# EAGLE design pc-bus (EAGLE 9.6.2)
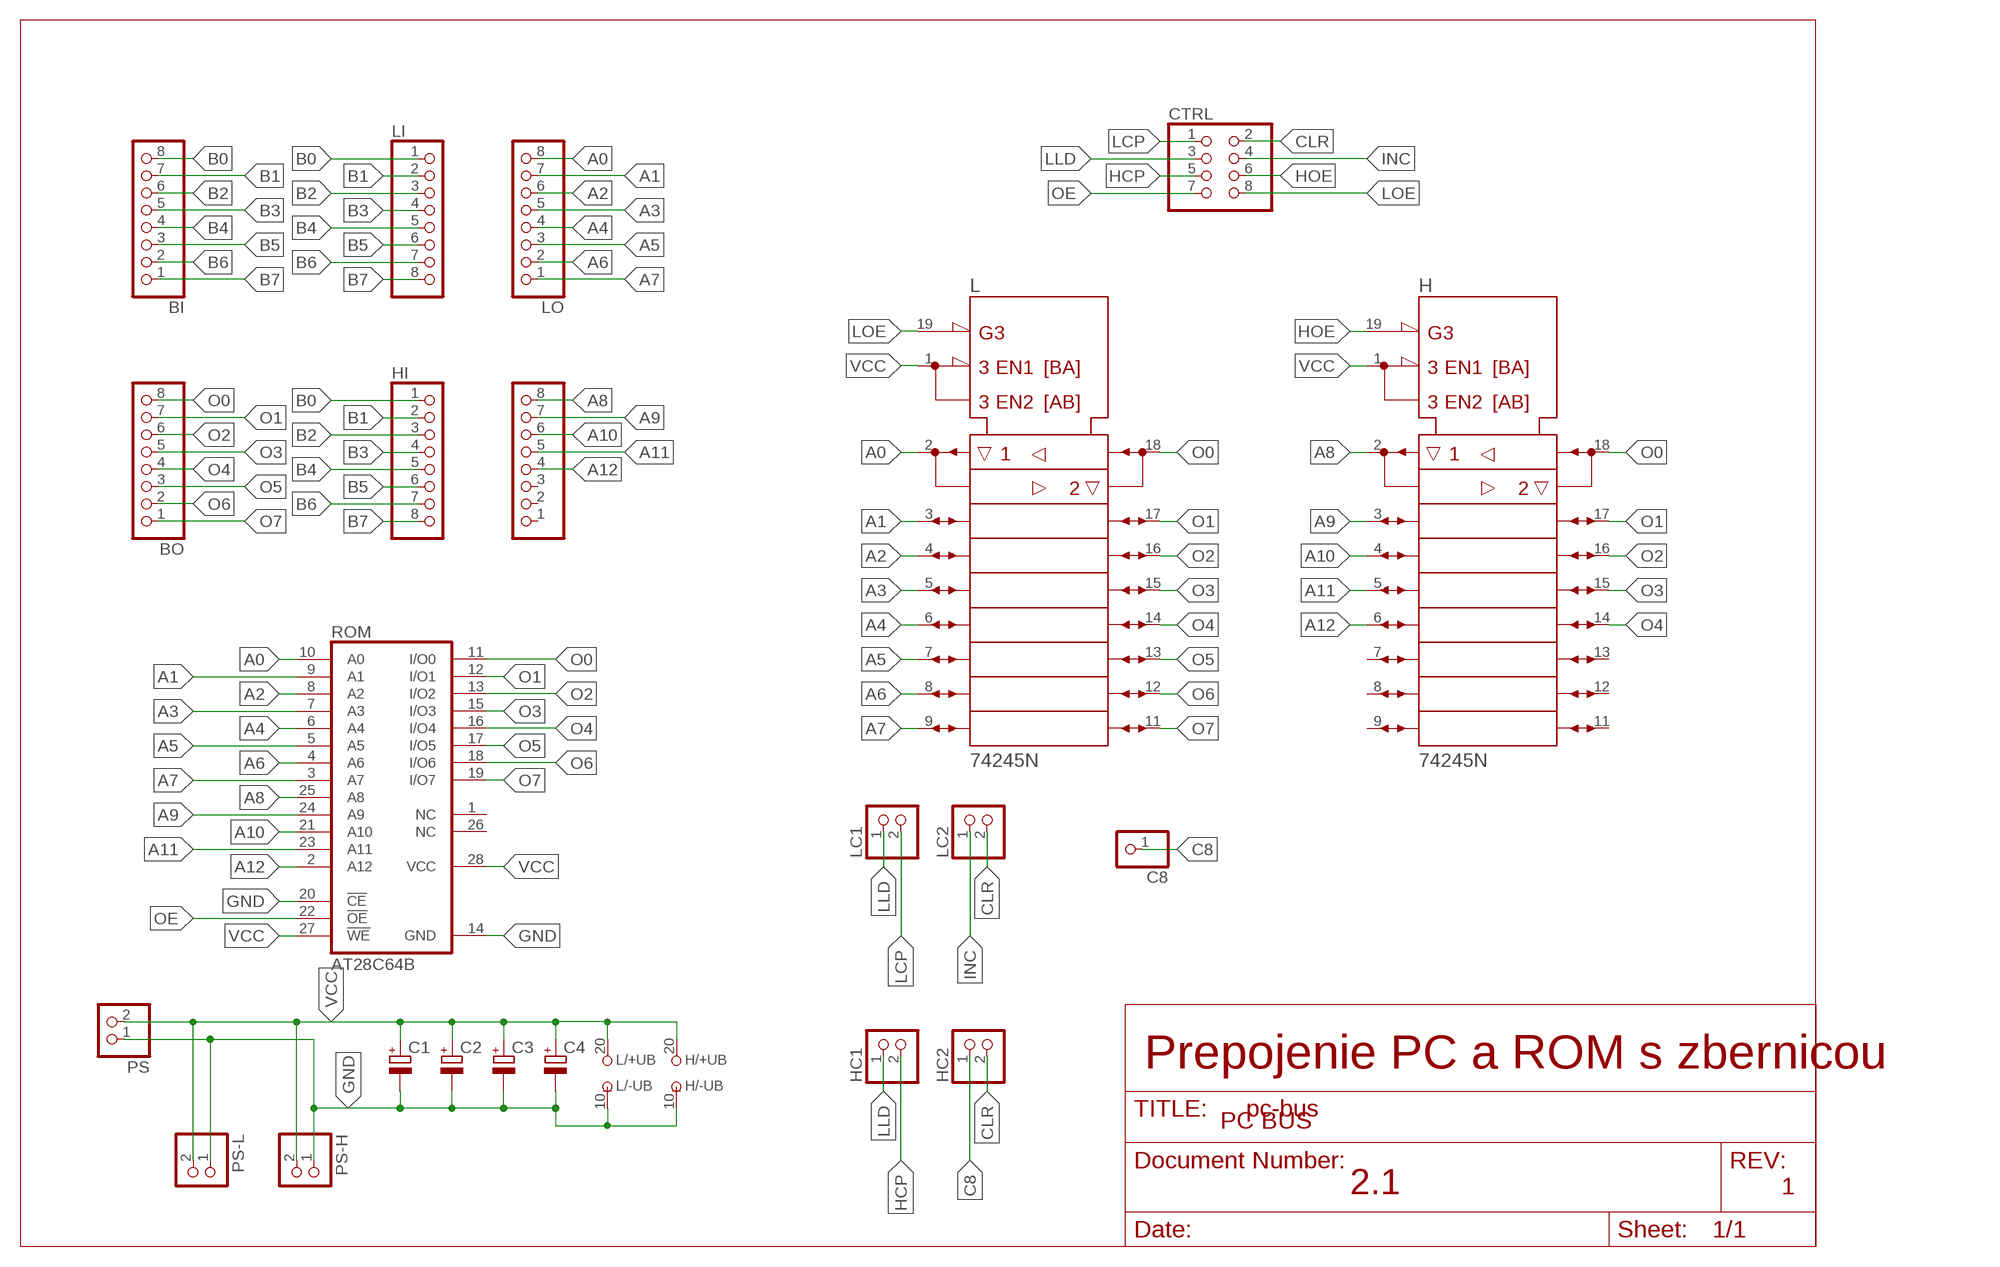
[diagram p0: schematic, sheet 1]

## Parts
BI  PINHD-1X8  [1X08]
BO  PINHD-1X8  [1X08]
C1  CPOL-EUE2.5-6  [E2,5-6]
C2  CPOL-EUE2.5-6  [E2,5-6]
C3  CPOL-EUE2.5-6  [E2,5-6]
C4  CPOL-EUE2.5-6  [E2,5-6]
C8  PINHD-1X1  [1X01]
CTRL  PINHD-2X4  [2X04]
H  74245N  [DIL20]
HC1  PINHD-1X2  [1X02]
HC2  PINHD-1X2  [1X02]
HI  PINHD-1X8  [1X08]
HO  PINHD-1X8  [1X08]
L  74245N  [DIL20]
LC1  PINHD-1X2  [1X02]
LC2  PINHD-1X2  [1X02]
LI  PINHD-1X8  [1X08]
LO  PINHD-1X8  [1X08]
PS  PINHD-1X2  [1X02]
PS-H  PINHD-1X2  [1X02]
PS-L  PINHD-1X2  [1X02]
ROM  AT28C64B  28C64C  [DIL28-6]

## Nets
A0: L.2(A1) LO.8 ROM.10(A0)
A1: L.3(A2) LO.7 ROM.9(A1)
A2: L.4(A3) LO.6 ROM.8(A2)
A3: L.5(A4) LO.5 ROM.7(A3)
A4: L.6(A5) LO.4 ROM.6(A4)
A5: L.7(A6) LO.3 ROM.5(A5)
A6: L.8(A7) LO.2 ROM.4(A6)
A7: L.9(A8) LO.1 ROM.3(A7)
A8: H.2(A1) HO.8 ROM.25(A8)
A9: H.3(A2) HO.7 ROM.24(A9)
A10: H.4(A3) HO.6 ROM.21(A10)
A11: H.5(A4) HO.5 ROM.23(A11)
A12: H.6(A5) HO.4 ROM.2(A12)
B0: BI.8 HI.1 LI.1
B1: BI.7 HI.2 LI.2
B2: BI.6 HI.3 LI.3
B3: BI.5 HI.4 LI.4
B4: BI.4 HI.5 LI.5
B5: BI.3 HI.6 LI.6
B6: BI.2 HI.7 LI.7
B7: BI.1 HI.8 LI.8
C8: C8.1 HC2.1
CLR: CTRL.2 HC2.2 LC2.2
GND: C1.- C2.- C3.- C4.- H.10(-UB) L.10(-UB) PS-H.1 PS-L.1 PS.1 ROM.14(GND) ROM.20(!CE)
HCP: CTRL.5 HC1.2
HOE: CTRL.6 H.19(!G)
INC: CTRL.4 LC2.1
LCP: CTRL.1 LC1.2
LLD: CTRL.3 HC1.1 LC1.1
LOE: CTRL.8 L.19(!G)
O0: BO.8 H.18(B1) L.18(B1) ROM.11(I/O0)
O1: BO.7 H.17(B2) L.17(B2) ROM.12(I/O1)
O2: BO.6 H.16(B3) L.16(B3) ROM.13(I/O2)
O3: BO.5 H.15(B4) L.15(B4) ROM.15(I/O3)
O4: BO.4 H.14(B5) L.14(B5) ROM.16(I/O4)
O5: BO.3 L.13(B6) ROM.17(I/O5)
O6: BO.2 L.12(B7) ROM.18(I/O6)
O7: BO.1 L.11(B8) ROM.19(I/O7)
OE: CTRL.7 ROM.22(!OE)
VCC: C1.+ C2.+ C3.+ C4.+ H.1(DIR) H.20(+UB) L.1(DIR) L.20(+UB) PS-H.2 PS-L.2 PS.2 ROM.27(!WE) ROM.28(VCC)
Unconnected: H.7(A6) H.8(A7) H.9(A8) H.11(B8) H.12(B7) H.13(B6) HO.1 HO.2 HO.3 ROM.1(NC) ROM.26(NC)

## Notes on the sheet
- Prepojenie PC a ROM s zbernicou
- PC BUS
- 2.1 | 1

## Library data of the parts
BI BO HI HO LI LO = pinhead:PINHD-1X8: PIN HEADER
C1-C4 = rcl:CPOL-EU: POLARIZED CAPACITOR, European symbol; SPICEPREFIX: C
C8 = pinhead:PINHD-1X1: PIN HEADER
CTRL = pinhead:PINHD-2X4: PIN HEADER
H L = 74ttl-din:74*245: Octal BUS TRANSCEIVER, 3-state
HC1 HC2 LC1 LC2 PS PS-H PS-L = pinhead:PINHD-1X2: PIN HEADER
ROM = memory-nec:28C64C: MEMORY; MPN: AT28C64B-15PU; OC_FARNELL: 1095784; OC_NEWARK: 96K6557

## Board
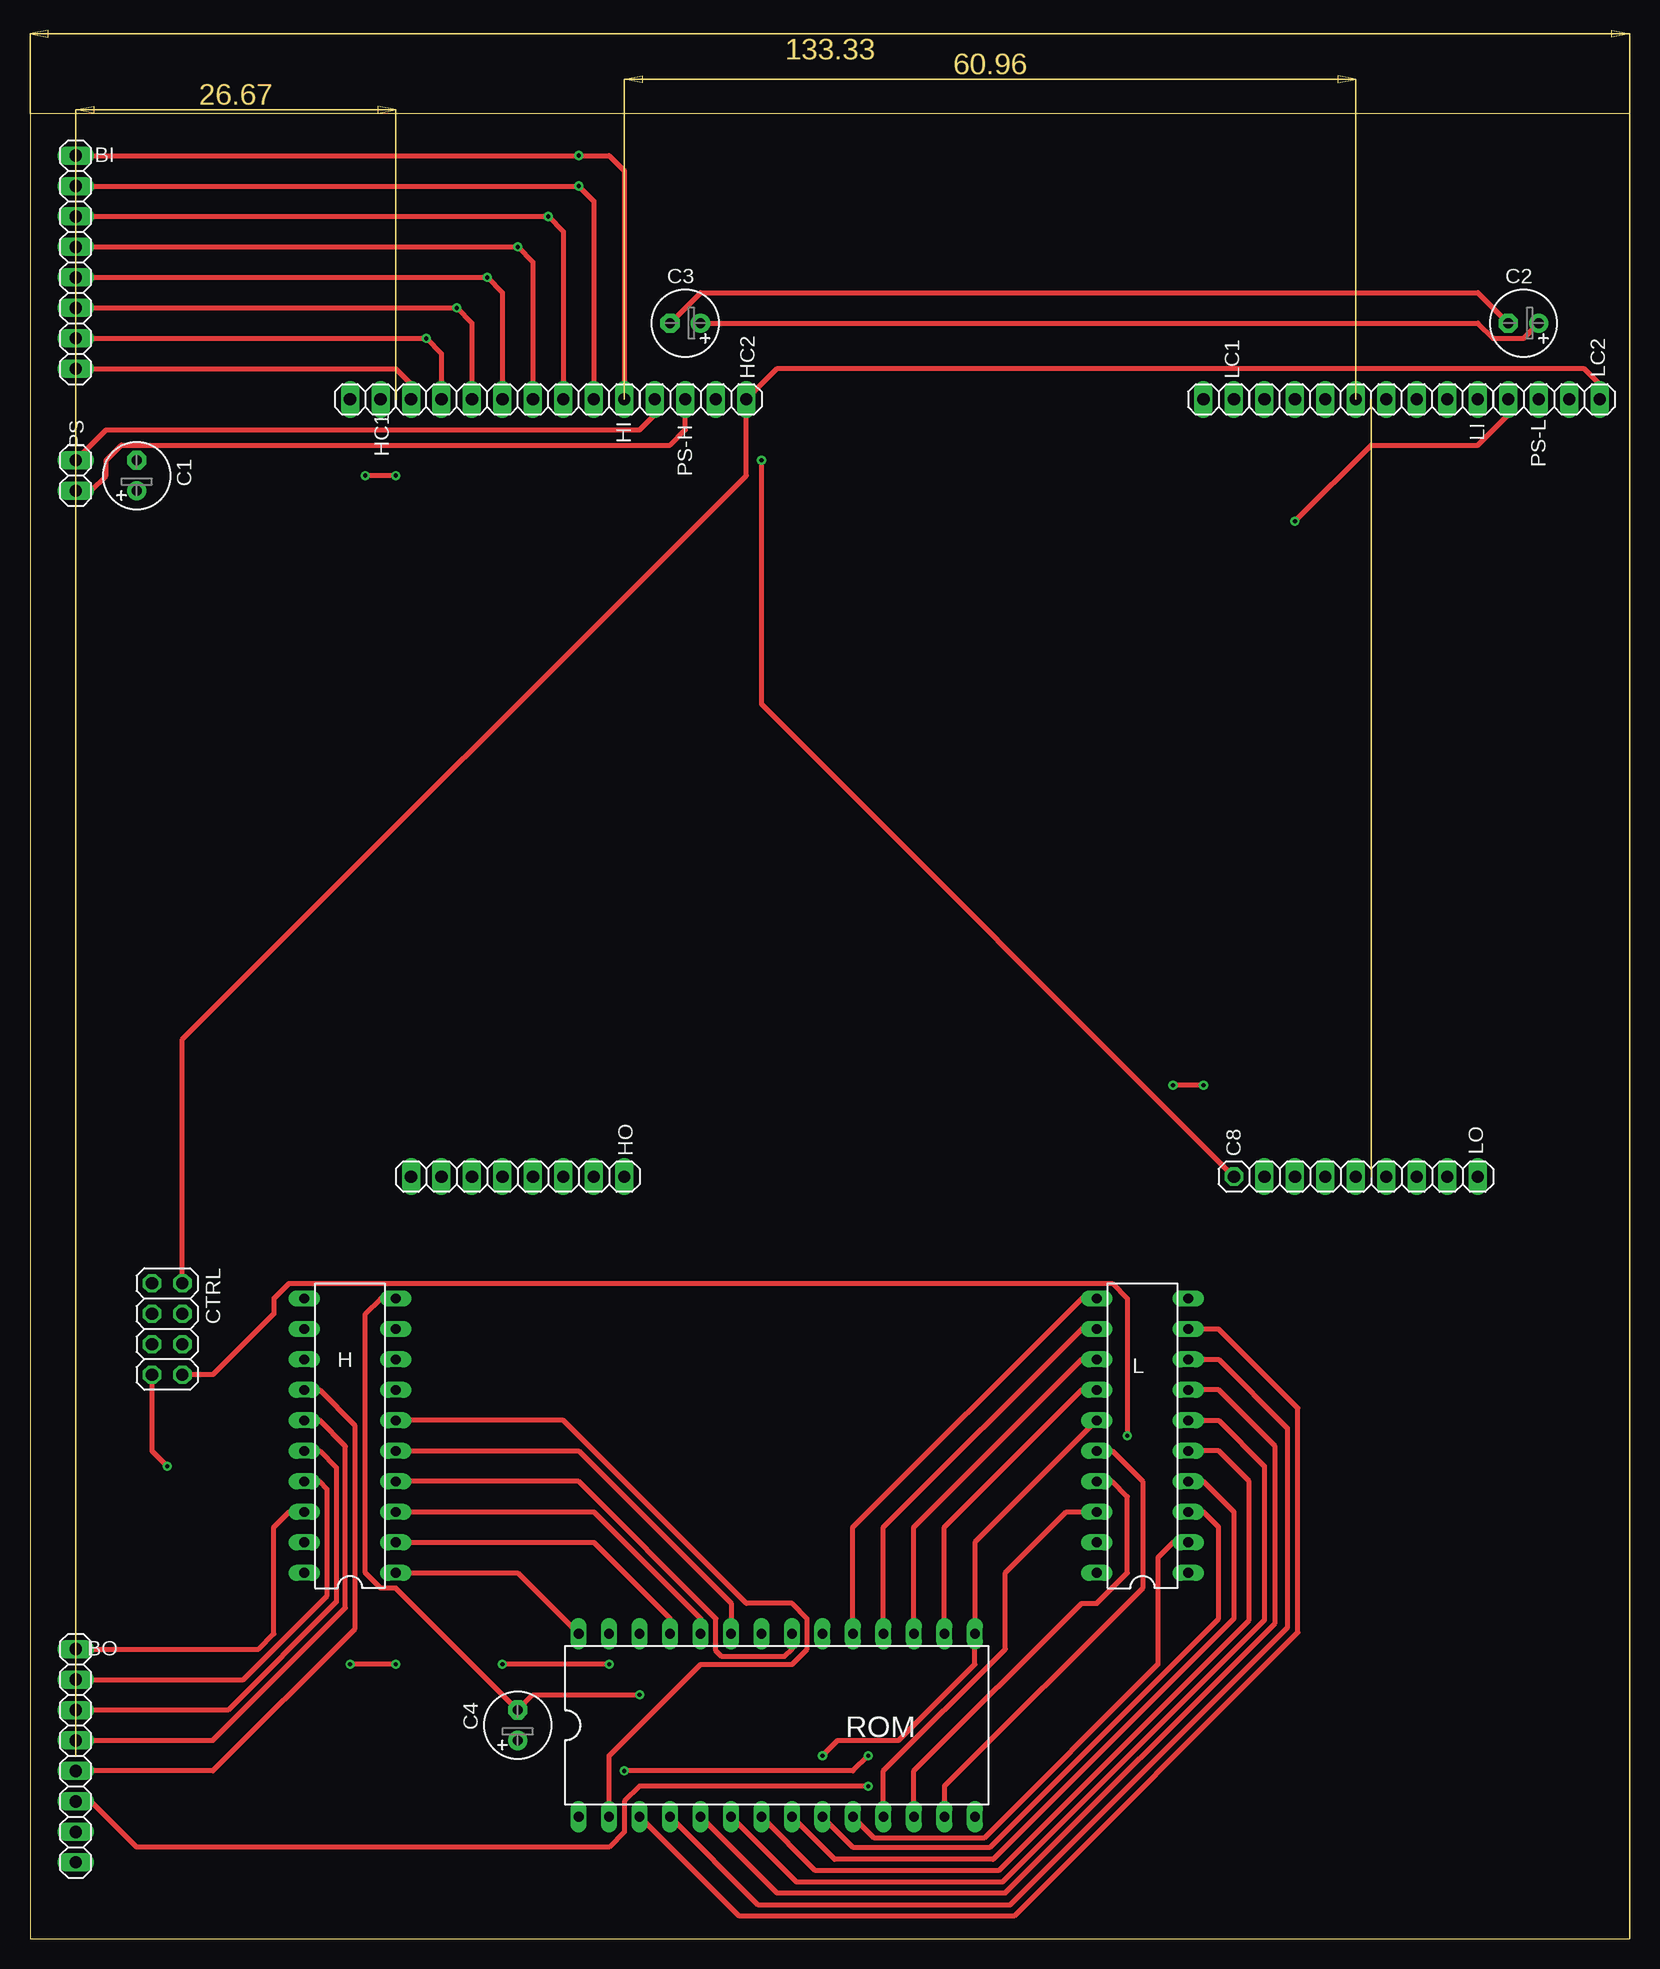
[diagram p1: board, top side]
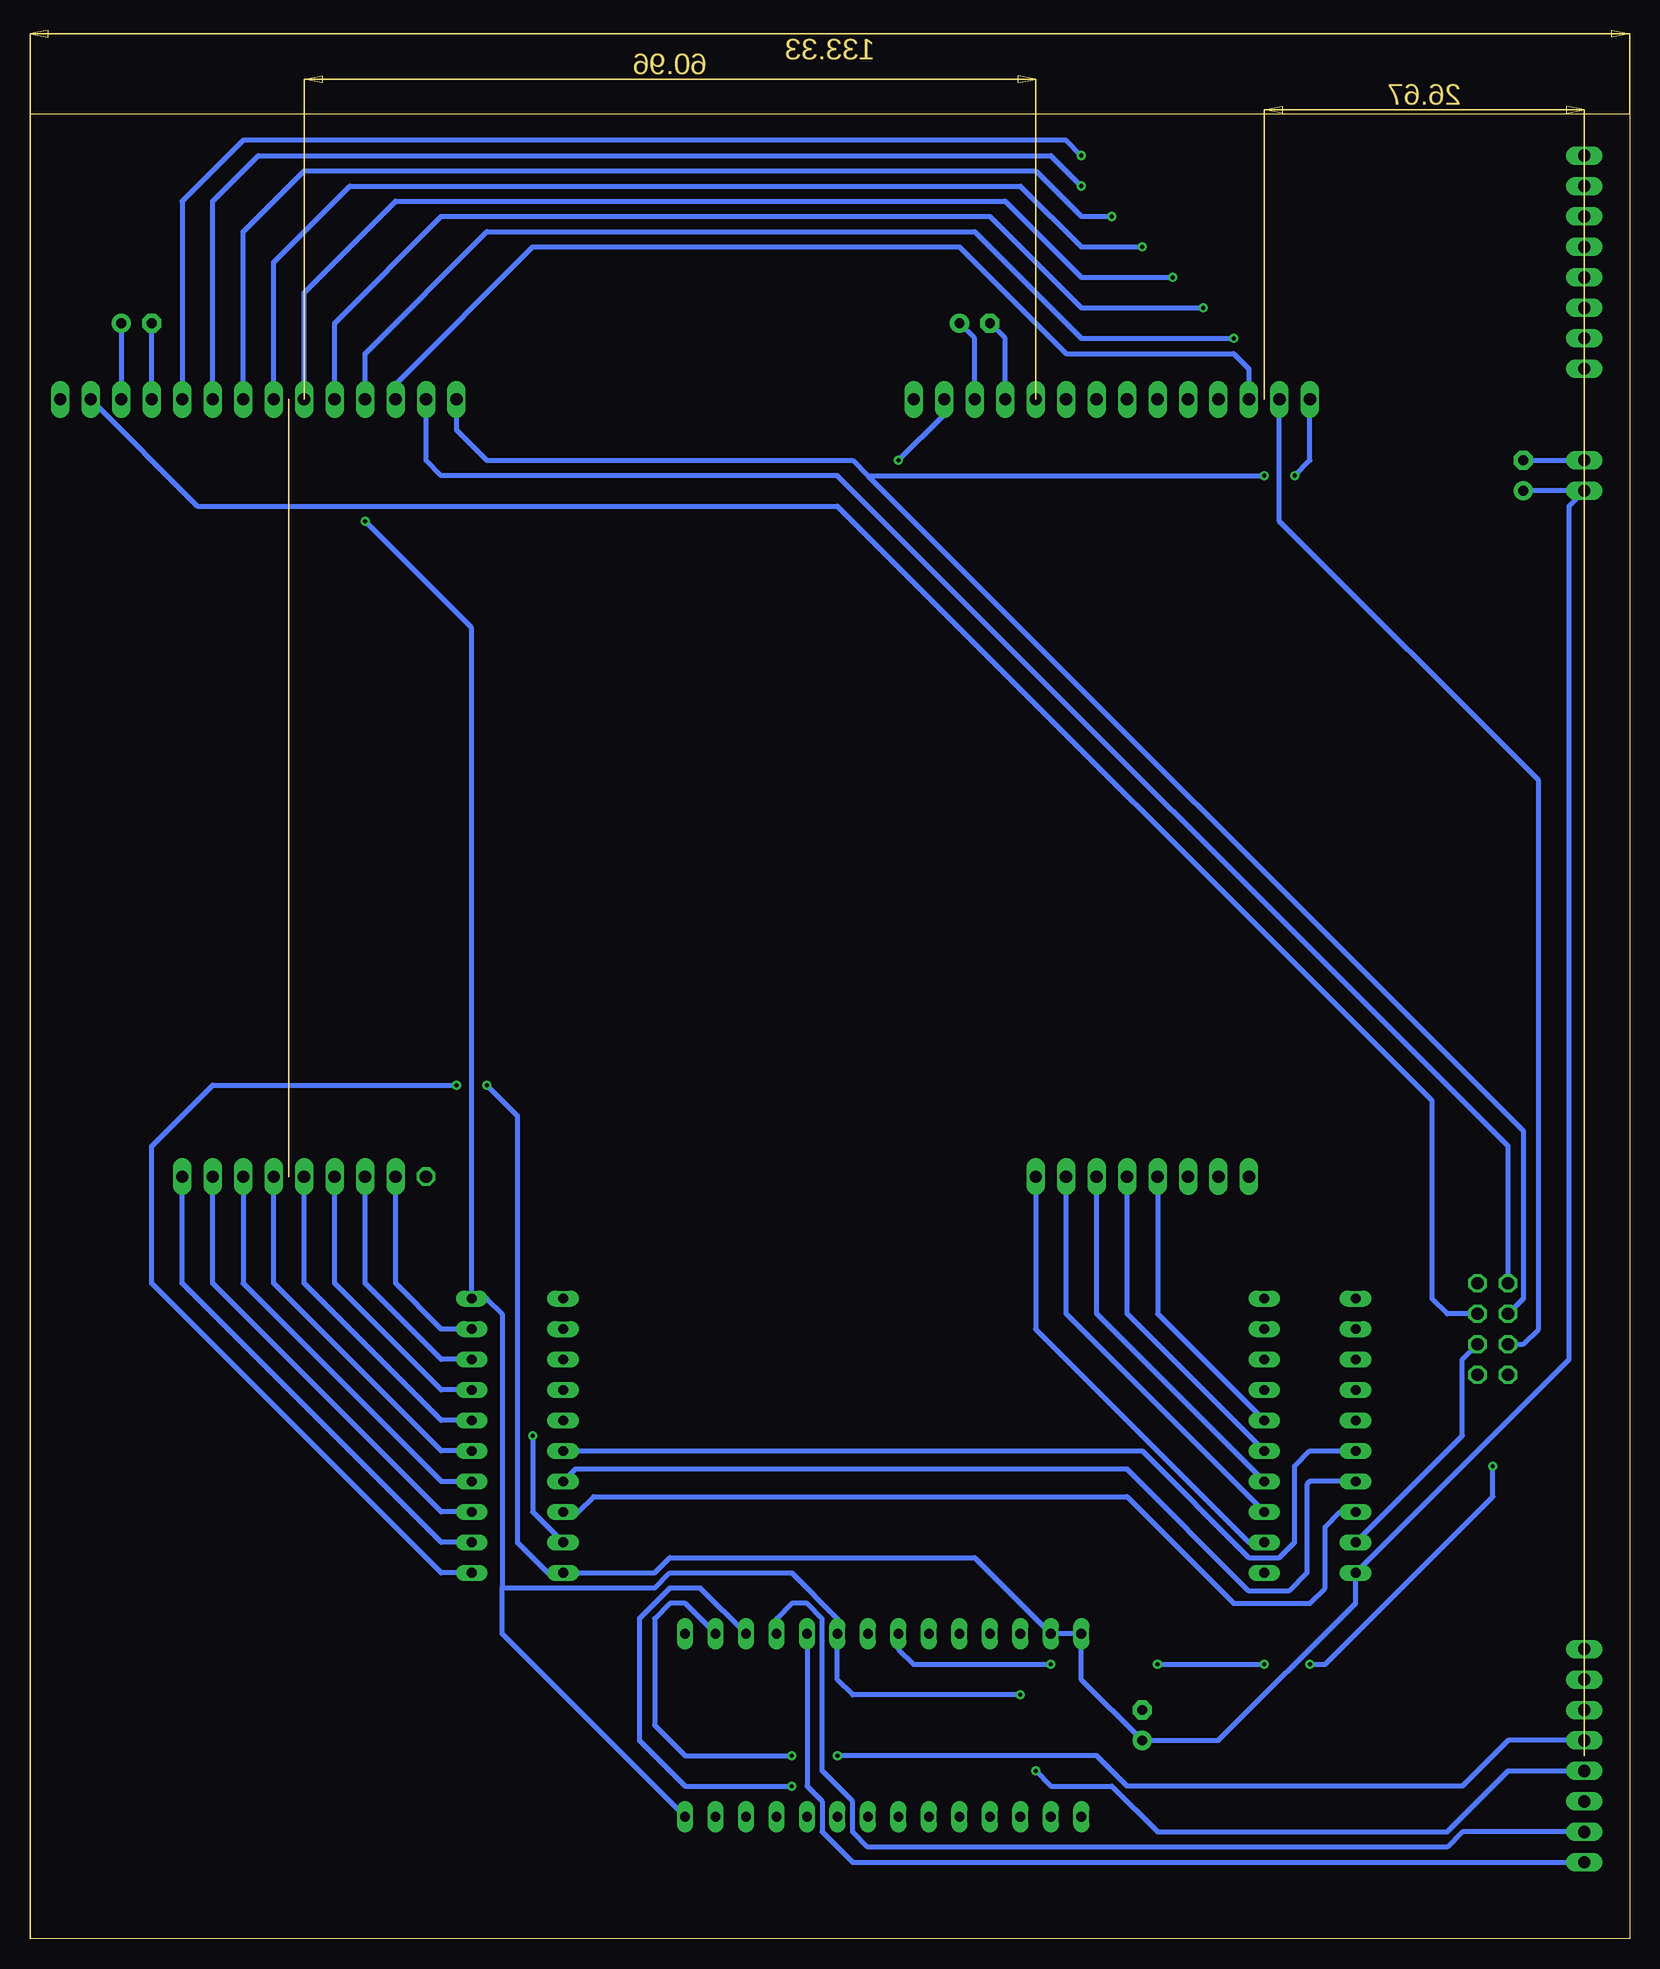
[diagram p2: board, bottom side, seen from below]

Size 133.33 x 152.07 mm. Coordinates in mm from the lower left corner, seen from the top.
Outline: 0,0 133.33,0 133.33,152.07 0,152.07 0,0
Copper layers (1*16): Top 0.035mm / dielectric 1.5mm / Bottom 0.035mm
Design rules "default": minimum track width 6mil, minimum drill 0.35mm, track to track 6mil, track to pad 6mil, pad to pad 6mil, via to via 6mil, smd to smd 6mil, copper to edge 40mil, drill to drill 6mil, minimum pad ring 10mil, minimum via ring 8mil, stop-mask expansion 4mil, vias tented up to drill 0mil, thermal gap 10mil

### Footprints (pad centres in the part's own frame; a part is rotated, then mirrored left to right if it is on the bottom)
1X08 = drill 1.016 long: 1 -8.89,0; 2 -6.35,0; 3 -3.81,0; 4 -1.27,0; 5 1.27,0; 6 3.81,0; 7 6.35,0; 8 8.89,0
E2,5-6 = drill 0.813 pad 1.6: + -1.27,0 | drill 0.813 pad 1.6 octagon: - 1.27,0
1X01 = drill 1.016 octagon: 1 0,0
2X04 = drill 1.016 octagon: 1 -3.81,-1.27; 2 -3.81,1.27; 3 -1.27,-1.27; 4 -1.27,1.27; 5 1.27,-1.27; 6 1.27,1.27; 7 3.81,-1.27; 8 3.81,1.27
DIL20 = drill 0.813 long: 1 -11.43,-3.81; 2 -8.89,-3.81; 3 -6.35,-3.81; 4 -3.81,-3.81; 5 -1.27,-3.81; 6 1.27,-3.81; 7 3.81,-3.81; 8 6.35,-3.81; 9 8.89,-3.81; 10 11.43,-3.81; 11 11.43,3.81; 12 8.89,3.81; 13 6.35,3.81; 14 3.81,3.81; 15 1.27,3.81; 16 -1.27,3.81; 17 -3.81,3.81; 18 -6.35,3.81; 19 -8.89,3.81; 20 -11.43,3.81
1X02 = drill 1.016 long: 1 -1.27,0; 2 1.27,0
DIL28-6 = drill 0.813 long: 1 -16.51,-7.62; 2 -13.97,-7.62; 3 -11.43,-7.62; 4 -8.89,-7.62; 5 -6.35,-7.62; 6 -3.81,-7.62; 7 -1.27,-7.62; 8 1.27,-7.62; 9 3.81,-7.62; 10 6.35,-7.62; 11 8.89,-7.62; 12 11.43,-7.62; 13 13.97,-7.62; 14 16.51,-7.62; 15 16.51,7.62; 16 13.97,7.62; 17 11.43,7.62; 18 8.89,7.62; 19 6.35,7.62; 20 3.81,7.62; 21 1.27,7.62; 22 -1.27,7.62; 23 -3.81,7.62; 24 -6.35,7.62; 25 -8.89,7.62; 26 -11.43,7.62; 27 -13.97,7.62; 28 -16.51,7.62

### Placement (x,y rotation side)
BI  3.81,139.7 90 top
BO  3.81,15.24 90 top
C1  8.89,121.92 90 top
C2  124.46,134.62 180 top
C3  54.61,134.62 180 top
C4  40.64,17.78 90 top
C8  100.33,63.5 0 top
CTRL  11.43,50.8 270 top
H  26.67,41.91 90 top
HC1  27.94,128.27 0 top
HC2  58.42,128.27 0 top
HI  40.64,128.27 180 top
HO  40.64,63.5 0 top
L  92.71,41.91 90 top
LC1  99.06,128.27 0 top
LC2  129.54,128.27 0 top
LI  111.76,128.27 180 top
LO  111.76,63.5 0 top
PS  3.81,121.92 270 top
PS-H  53.34,128.27 0 top
PS-L  124.46,128.27 0 top
ROM  62.23,17.78 0 top

### Tracks (layer width: path | path; a pad name or v marks a point on that pad's centre or on a via)
A0
  Top 0.4: L.2 95.25,33.02 93.98,31.75 93.98,22.86 79.5,8.38 70.36,8.38 ROM.10
  Bottom 0.4: L.2 99.06,33.02 120.65,54.61 LO.8
A1
  Top 0.4: ROM.9 68.58,7.62 80.01,7.62 99.06,26.67 99.06,34.29 97.79,35.56 L.3
  Bottom 0.4: L.3 99.06,35.56 118.11,54.61 LO.7
A2
  Top 0.4: L.4 97.79,38.1 100.33,35.56 100.33,26.67 80.26,6.6 67.06,6.6 ROM.8
  Bottom 0.4: LO.6 115.57,54.61 99.06,38.1 L.4
A3
  Top 0.4: L.5 99.06,40.64 101.6,38.1 101.6,26.54 80.77,5.71 65.41,5.71 ROM.7
  Bottom 0.4: L.5 99.06,40.64 113.03,54.61 LO.5
A4
  Top 0.4: L.6 99.06,43.18 102.87,39.37 102.87,26.54 81.03,4.7 63.88,4.7 ROM.6
  Bottom 0.4: L.6 99.06,43.18 110.49,54.61 LO.4
A5
  Top 0.4: ROM.5 62.23,3.81 81.28,3.81 103.76,26.29 103.76,41.02 99.06,45.72 L.7
  Bottom 0.4: L.7 99.06,45.72 107.95,54.61 LO.3
A6
  Top 0.4: L.8 99.06,48.26 104.78,42.55 104.78,25.91 81.66,2.79 60.71,2.79 ROM.4
  Bottom 0.4: L.8 99.06,48.26 105.41,54.61 LO.2
A7
  Top 0.4: ROM.3 59.05,1.91 82.04,1.91 105.66,25.53 105.66,44.2 99.06,50.8 L.9
  Bottom 0.4: L.9 99.06,50.8 102.87,54.61 LO.1
A8
  Top 0.4: H.2 46.99,33.02 53.34,26.67 ROM.25
  Bottom 0.4: HO.8 49.53,50.8 31.75,33.02 H.2
A9
  Top 0.4: H.3 46.99,35.56 55.88,26.67 ROM.24
  Bottom 0.4: H.3 46.99,52.07 HO.7
A10
  Top 0.4: ROM.21 63.5,24.13 62.87,23.5 57.66,23.5 57.15,24 57.15,26.67 45.72,38.1 H.4
  Bottom 0.4: H.4 44.45,52.07 HO.6
A11
  Top 0.4: H.5 45.72,40.64 58.42,27.94 ROM.23
  Bottom 0.4: H.5 41.91,52.07 HO.5
A12
  Top 0.4: ROM.2 48.26,15.24 55.88,22.86 63.5,22.86 64.77,24.13 64.77,26.67 63.5,27.94 59.69,27.94 44.45,43.18 H.6
  Bottom 0.4: HO.4 39.37,52.07 H.6
B0  (via drill 0.35)
  Top 0.4: BI.8 v45.72,148.59 48.26,148.59 49.53,147.32 HI.1
  Bottom 0.4: v45.72,148.59 46.99,149.86 115.57,149.86 120.65,144.78 LI.1
B1  (via drill 0.35)
  Top 0.4: BI.7 v45.72,146.05 46.99,144.78 HI.2
  Bottom 0.4: LI.2 118.11,144.78 114.3,148.59 48.26,148.59 v45.72,146.05
B2  (via drill 0.35)
  Top 0.4: BI.6 v43.18,143.51 44.45,142.24 HI.3
  Bottom 0.4: LI.3 115.57,142.24 110.49,147.32 49.53,147.32 45.72,143.51 v43.18,143.51
B3  (via drill 0.35)
  Top 0.4: BI.5 v40.64,140.97 41.91,139.7 HI.4
  Bottom 0.4: LI.4 113.03,139.7 106.68,146.05 50.8,146.05 45.72,140.97 v40.64,140.97
B4  (via drill 0.35)
  Top 0.4: BI.4 v38.1,138.43 39.37,137.16 HI.5
  Bottom 0.4: LI.5 110.49,137.16 102.87,144.78 52.07,144.78 45.72,138.43 v38.1,138.43
B5  (via drill 0.35)
  Top 0.4: BI.3 v35.56,135.89 36.83,134.62 HI.6
  Bottom 0.4: LI.6 107.95,134.62 99.06,143.51 53.34,143.51 45.72,135.89 v35.56,135.89
B6  (via drill 0.35)
  Top 0.4: BI.2 v33.02,133.35 34.29,132.08 HI.7
  Bottom 0.4: LI.7 105.41,132.08 95.25,142.24 54.61,142.24 45.72,133.35 v33.02,133.35
B7
  Top 0.4: BI.1 30.48,130.81 31.75,129.54 HI.8
  Bottom 0.4: LI.8 102.87,129.54 91.44,140.97 55.88,140.97 46.99,132.08 33.02,132.08 31.75,130.81 HI.8
C8  (via drill 0.35)
  Top 0.4: C8.1 60.96,102.87 v60.96,123.19
  Bottom 0.4: v60.96,123.19 57.15,127 HC2.1
CLR
  Top 0.4: LC2.2 130.81,129.54 129.54,130.81 62.23,130.81 HC2.2 59.69,121.92 12.7,74.93 CTRL.2
GND  (via drill 0.35)
  Top 0.4: PS.1 6.35,125.73 50.8,125.73 52.07,127 PS-H.1 | C3.- 55.88,137.16 120.65,137.16 C2.- | H.10 29.21,53.34 27.94,52.07 27.94,30.48 29.21,29.21 30.48,29.21 C4.- 41.91,20.32 v50.8,20.32 | v105.41,118.11 111.76,124.46 120.65,124.46 123.19,127 PS-L.1
  Bottom 0.4: PS-H.1 52.07,133.35 C3.- | PS-L.1 C2.- | C1.- PS.1 | 93.98,29.21 81.28,29.21 80.01,30.48 69.85,30.48 66.04,26.67 ROM.20 66.04,21.59 64.77,20.32 v50.8,20.32 | v105.41,118.11 96.52,109.22 L.10 95.25,53.34 93.98,52.07 93.98,29.21 | 93.98,29.21 93.98,25.4 ROM.14
HCP
  Bottom 0.4: HC1.2 29.21,118.11 7.62,96.52 7.62,50.8 8.89,49.53 CTRL.5
HOE
  Bottom 0.4: H.19 13.97,41.91 13.97,48.26 CTRL.6
INC
  Bottom 0.4: LC2.1 119.38,119.38 66.04,119.38 16.51,69.85 16.51,53.34 15.24,52.07 CTRL.4
LCP
  Bottom 0.4: LC1.2 100.33,123.19 99.06,121.92 66.04,121.92 10.16,66.04 CTRL.1
LLD  (via drill 0.35)
  Top 0.4: v30.48,121.92 v27.94,121.92
  Bottom 0.4: LC1.1 97.79,125.73 95.25,123.19 64.77,123.19 63.5,121.92 | 63.5,121.92 8.89,67.31 8.89,53.34 CTRL.3 | 63.5,121.92 v30.48,121.92 | v27.94,121.92 26.67,123.19 HC1.1
LOE  (via drill 0.35)
  Top 0.4: v91.44,41.91 91.44,53.34 90.17,54.61 21.59,54.61 20.32,53.34 20.32,52.07 15.24,46.99 CTRL.8
  Bottom 0.4: v91.44,41.91 91.44,35.56 L.19
O0
  Top 0.4: ROM.11 71.12,13.97 81.28,24.13 81.28,30.48 86.36,35.56 L.18 | BO.8 19.05,24.13 20.32,25.4 20.32,34.29 21.59,35.56 H.18
  Bottom 0.4: L.18 87.63,35.56 86.36,36.83 41.91,36.83 33.02,27.94 26.67,27.94 25.4,29.21 25.4,34.29 24.13,35.56 H.18
O1
  Top 0.4: ROM.12 73.66,13.97 87.63,27.94 88.9,27.94 91.44,30.48 91.44,36.83 90.17,38.1 L.17 | BO.7 17.78,21.59 24.77,28.57 24.77,37.47 24.13,38.1 H.17
  Bottom 0.4: H.17 26.67,38.1 26.92,37.85 26.92,30.48 28.45,28.96 31.75,28.96 41.91,39.12 87.88,39.12 L.17
O2
  Top 0.4: L.16 90.17,40.64 92.71,38.1 92.71,29.21 76.2,12.7 ROM.13 | H.16 24.13,40.64 25.53,39.24 25.53,28.07 16.51,19.05 BO.6
  Bottom 0.4: H.16 26.67,40.64 27.94,39.37 27.94,33.02 29.21,31.75 31.75,31.75 40.64,40.64 L.16
O3  (via drill 0.35)
  Top 0.4: L.15 78.74,33.02 ROM.15 78.74,22.86 72.39,16.51 67.31,16.51 v66.04,15.24 | BO.5 15.24,16.51 26.29,27.56 26.29,41.02 24.13,43.18 H.15
  Bottom 0.4: BO.5 10.16,16.51 13.97,12.7 41.91,12.7 44.45,15.24 v66.04,15.24
O4  (via drill 0.35)
  Top 0.4: ROM.16 76.2,34.29 87.63,45.72 L.14 | H.14 24.13,45.72 27.05,42.8 27.05,25.78 15.24,13.97 BO.4 | v69.85,15.24 68.58,13.97 v49.53,13.97
  Bottom 0.4: ROM.16 78.74,27.94 80.01,27.94 81.28,26.67 81.28,17.78 78.74,15.24 v69.85,15.24 | v49.53,13.97 48.26,12.7 43.18,12.7 39.37,8.89 15.24,8.89 10.16,13.97 BO.4
O5  (via drill 0.35)
  Top 0.4: ROM.17 73.66,34.29 87.63,48.26 L.13 | v69.85,12.7 50.8,12.7 49.53,11.43 49.53,8.89 48.26,7.62 8.89,7.62 5.08,11.43 BO.3
  Bottom 0.4: v69.85,12.7 78.74,12.7 82.55,16.51 82.55,26.67 80.01,29.21 77.47,29.21 ROM.17
O6
  Top 0.4: ROM.18 71.12,34.29 87.63,50.8 L.12
  Bottom 0.4: BO.2 13.97,8.89 15.24,7.62 63.5,7.62 64.77,8.89 64.77,11.43 67.31,13.97 67.31,26.67 68.58,27.94 69.85,27.94 71.12,26.67 ROM.18
O7
  Top 0.4: ROM.19 68.58,34.29 87.63,53.34 L.11
  Bottom 0.4: BO.1 64.77,6.35 67.31,8.89 67.31,11.43 68.58,12.7 ROM.19
OE  (via drill 0.35)
  Top 0.4: v30.48,22.86 v26.67,22.86 | v48.26,22.86 v39.37,22.86 | CTRL.7 10.16,40.64 v11.43,39.37
  Bottom 0.4: ROM.22 60.96,24.13 59.69,22.86 v48.26,22.86 | v39.37,22.86 v30.48,22.86 | v26.67,22.86 25.4,22.86 11.43,36.83 v11.43,39.37
VCC  (via drill 0.35)
  Top 0.4: PS.2 5.08,120.65 6.35,121.92 6.35,123.19 7.62,124.46 53.34,124.46 54.61,125.73 PS-H.2 | C3.+ 120.65,134.62 121.92,133.35 124.46,133.35 C2.+ | v97.79,71.12 v95.25,71.12 | H.1 40.64,30.48 ROM.28
  Bottom 0.4: PS-H.2 54.61,133.35 C3.+ | C2.+ PS-L.2 | C1.+ PS.2 5.08,119.38 5.08,48.26 H.20 22.86,27.94 34.29,16.51 C4.+ 45.72,21.59 ROM.28 ROM.27 54.61,31.75 80.01,31.75 81.28,30.48 L.20 90.17,30.48 92.71,33.02 92.71,68.58 v95.25,71.12 | v97.79,71.12 118.11,71.12 123.19,66.04 123.19,54.61 99.06,30.48 L.1